# EAGLE design WBV2-final (EAGLE 9.6.2)
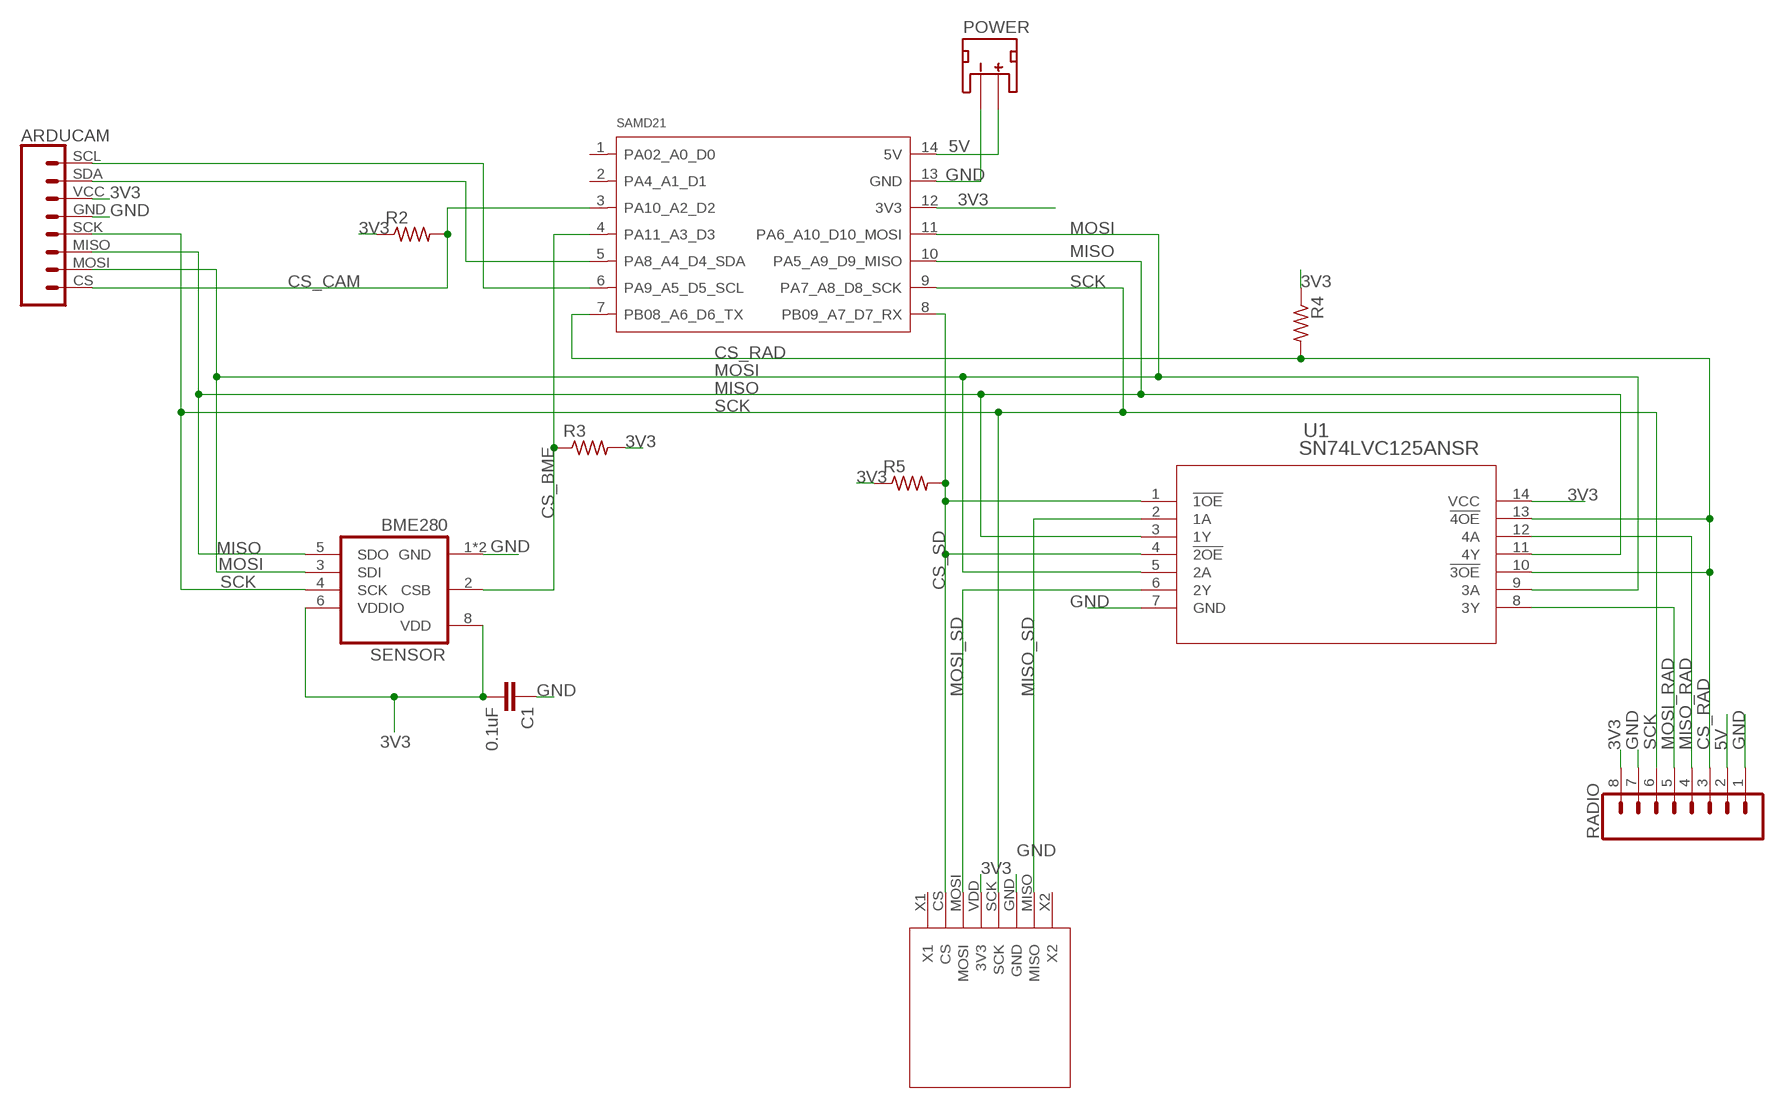
[diagram p0: schematic, sheet 1]

## Parts
C1  0.1uF  0.1UF-0402-16V-10%  [0402]
CAM  ARDUCAM_MINI  [ARDUCAM_MINI]
POWER  JST_2MM_MALE  [JST-2-SMD]
R2  R-US_R0402  [R0402]
R3  R-US_R0402  [R0402]
R4  R-US_R0402  [R0402]
R5  R-US_R0402  [R0402]
RADIO  CONN_08"  [1X08]
SAMD21  MOUDLE-SEEEDUINO-XIAO  [MOUDLE14P-2.54-21X17.8MM]
SD  SD_READER  [SDREAD]
SENSOR  BME280  [BME280]
U1  SN74LVC125ANSR  [NS14]

## Nets
3V3: C1.2 CAM.VCC R2.1 R3.2 R4.1 R5.1 RADIO.8 SAMD21.12(3V3) SD.VDD(3V3) SENSOR.6(VDDIO) SENSOR.8(VDD) U1.14(VCC)
5V: POWER.2(+) RADIO.2 SAMD21.14(5V)
CS_BME: R3.1 SAMD21.4(PA11_A3_D3) SENSOR.2(CSB)
CS_CAM: CAM.CS R2.2 SAMD21.3(PA10_A2_D2)
CS_RAD: R4.2 RADIO.3 SAMD21.7(PB08_A6_D6_TX) U1.10(!3OE) U1.13(!4OE)
CS_SD: R5.2 SAMD21.8(PB09_A7_D7_RX) SD.CS U1.1(!1OE) U1.4(!2OE)
GND: C1.1 CAM.GND POWER.1(-) RADIO.1 RADIO.7 SAMD21.13(GND) SD.GND SENSOR.1(GND) SENSOR.7(GND) U1.7(GND)
MISO: CAM.MISO SAMD21.10(PA5_A9_D9_MISO) SENSOR.5(SDO) U1.3(1Y) U1.11(4Y)
MISO_RAD: RADIO.4 U1.12(4A)
MISO_SD: SD.MISO U1.2(1A)
MOSI: CAM.MOSI SAMD21.11(PA6_A10_D10_MOSI) SENSOR.3(SDI) U1.5(2A) U1.9(3A)
MOSI_RAD: RADIO.5 U1.8(3Y)
MOSI_SD: SD.MOSI U1.6(2Y)
N$5: CAM.SDA SAMD21.5(PA8_A4_D4_SDA)
N$6: CAM.SCL SAMD21.6(PA9_A5_D5_SCL)
SCK: CAM.SCK RADIO.6 SAMD21.9(PA7_A8_D8_SCK) SD.SCK SENSOR.4(SCK)
Unconnected: POWER.NC1(PAD1) POWER.NC2(PAD2) SAMD21.1(PA02_A0_D0) SAMD21.2(PA4_A1_D1) SD.X1 SD.X2

## Library data of the parts
C1 = SparkFun-Capacitors:0.1UF: 0.1µF ceramic capacitors A capacitor is a passive two-terminal electrical component used to store electrical energy temporarily in an electric field.; PROD_ID: CAP-12416
CAM = project-library:ARDUCAM_MINI
POWER = SparkFun-Connectors:JST_2MM_MALE: JST 2MM MALE RA CONNECTOR Two pin, compact surface mount connector. Commonly used as a battery input connection point. We really like the solid locking feeling and high current rating on these small connectors. We use these all the time as battery connectors. Mates to single-cell LiPo batteries. Here is the connector we sell at SparkFun: JST Right Angle Connector - White <https://www.sparkfun.com/products/8612> (PRT-08612) Datasheet <http://www.sparkfun.com/datasheets/Prototyping/Connectors/JST-Horizontal.pdf> It was used on these SparkFun products: SparkFun MOSFET Power Controller <https://www.sparkfun.com/products/11214> (PRT-11214) SparkFun Battery Babysitter - LiPo Battery Manager <https://www.sparkfun.com/products/13777> (PRT-13777) And many, many others that required a lipo battery connection.; PROD_ID: CONN-11443; SF_ID: PRT-08612
R2-R5 = rcl:R-US_: RESISTOR, American symbol; SPICEPREFIX: R
RADIO = SparkFun-Connectors:CONN_08: Multi connection point. Often used as Generic Header-pin footprint for 0.1 inch spaced/style header connections On any of the 0.1 inch spaced packages, you can populate with these: Break Away Headers - Straight <https://www.sparkfun.com/products/116> (PRT-00116) Break Away Male Headers - Right Angle <https://www.sparkfun.com/products/553> (PRT-00553) Female Headers <https://www.sparkfun.com/products/115> (PRT-00115) Break Away Headers - Machine Pin <https://www.sparkfun.com/products/117> (PRT-00117) Break Away Female Headers - Swiss Machine Pin <https://www.sparkfun.com/products/743> (PRT-00743) Arduino Stackable Header - 8 Pin <https://www.sparkfun.com/products/9279> (PRT-09279) For SCREWTERMINALS and SPRING TERMINALS visit here: Screw Terimnals on SparkFun.com <https://www.sparkfun.com/search/results?term=Screw+Terminals> (5mm/3.5mm/2.54mm spacing) This device is also useful as a general connection point to wire up your design to another part of your project. Our various solder wires solder well into these plated through hole pads. Hook-Up Wire - Assortment (Stranded, 22 AWG) <https://www.sparkfun.com/products/11375> (PRT-11375) Hook-Up Wire - Assortment (Solid Core, 22 AWG) <https://www.sparkfun.com/products/11367> (PRT-11367) View the entire wire category on our website here <https://www.sparkfun.com/categories/141> Special notes: Molex polarized connector foot print use with SKU : PRT-08231 with associated crimp pins and housings. 1MM SMD Version SKU: PRT-10208 NOTES ON THE VARIANTS LOCK and LOCK_LONGPADS... This footprint was designed to help hold the alignment of a through-hole component (i.e. 6-pin header) while soldering it into place. You may notice that each hole has been shifted either up or down by 0.005 of an inch from it's more standard position (which is a perfectly straight line). This slight alteration caused the pins (the squares in the middle) to touch the edges of the holes. Because they are alternating, it causes a "brace" to hold the component in place. 0.005 has proven to be the perfect amount of "off-center" position when using our standard breakaway headers. Although looks a little odd when you look at the bare footprint, once you have a header in there, the alteration is very hard to notice. Also,if you push a header all the way into place, it is covered up entirely on the bottom side.; PROD_ID: CONN-08438
SAMD21 = Seeeduino-XIAO-footprint-eagle:MOUDLE-SEEEDUINO-XIAO
SD = project-library:SD_READER
SENSOR = bosch-bme280:BME280: DIGITAL HUMIDITY, PRESSURE AND TEMPERATURE SENSOR * Digital interface I²C (up to 3.4 MHz) and SPI (3 and 4 wire, up to 10 MHz)* Supply voltage VDD main supply voltage range: 1.71 V to 3.6 V*VDDIO interface voltage range: 1.2 V to 3.6 V Operating range -40…+85 °C, 0…100 % rel. humidity, 300…1100 hPa The library has been designed by Richard Magdycz <https://www.facebook.com/groups/eaglecadsoftUK>
U1 = SN74LVC125ANSR:SN74LVC125ANSR; COPYRIGHT: Copyright (C) 2024 Ultra Librarian. All rights reserved.; MANUFACTURER_PART_NUMBER: SN74LVC125ANSR; MFR_NAME: Texas Instruments

## Board
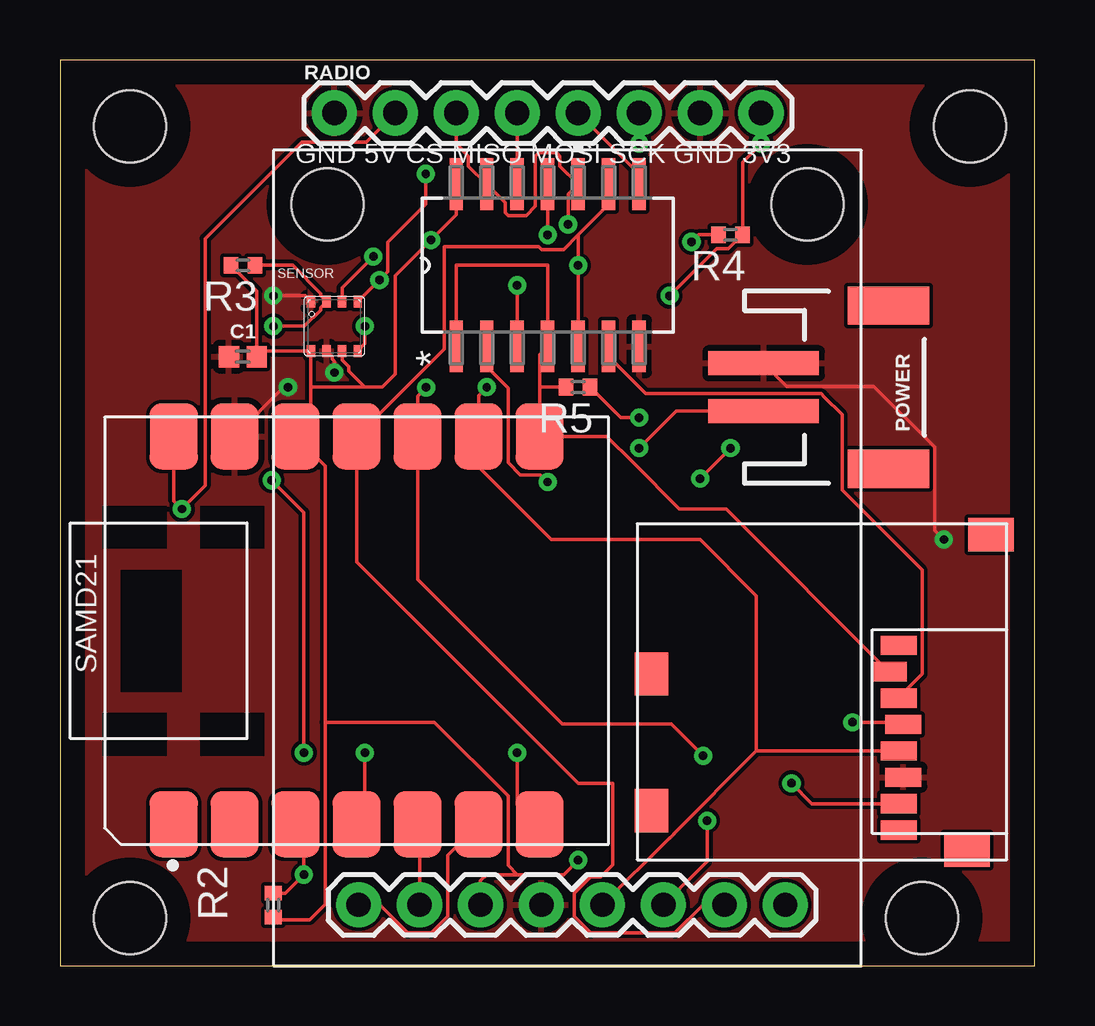
[diagram p1: board, top side]
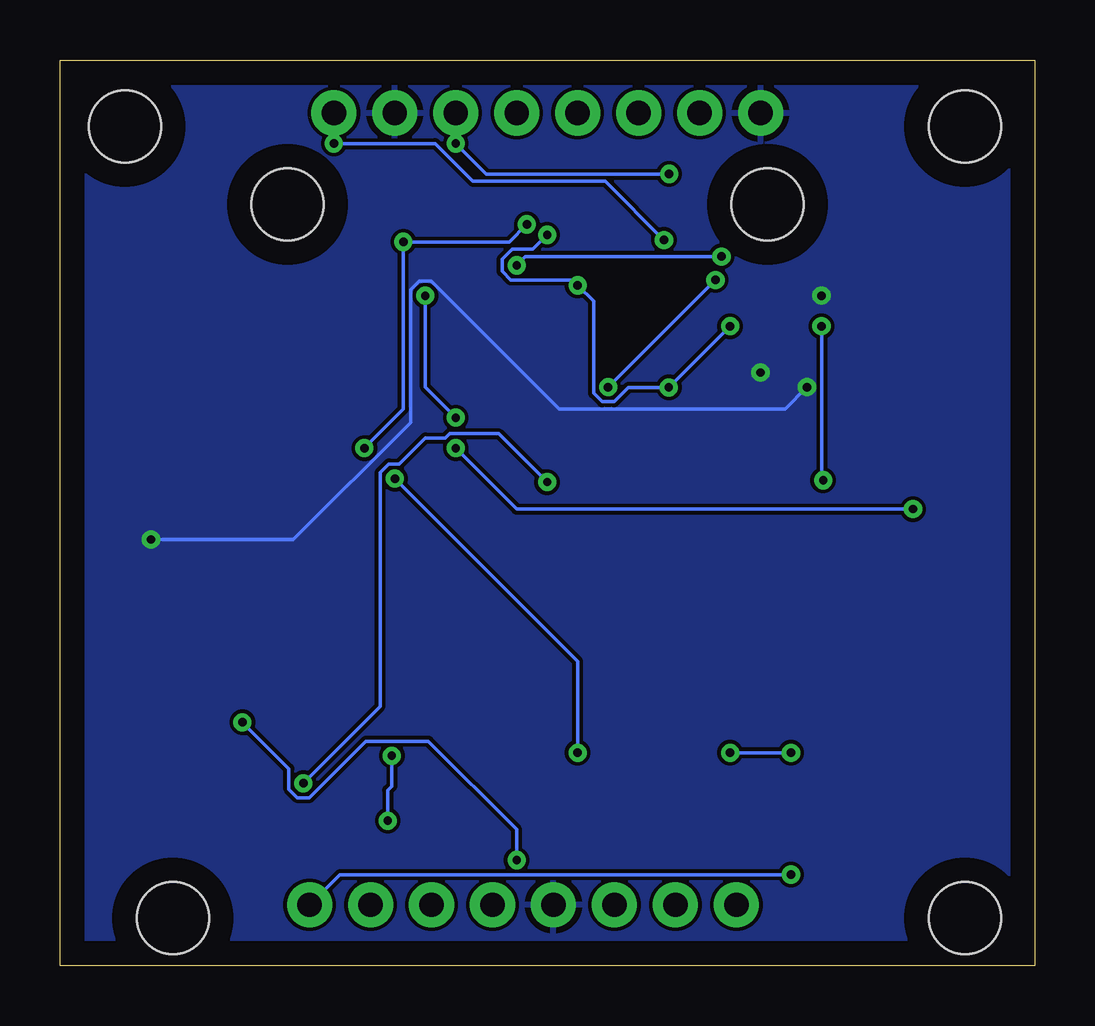
[diagram p2: board, bottom side, seen from below]

Size 40.62 x 37.77 mm. Coordinates in mm from the lower left corner, seen from the top.
Outline: 0,0 40.62,0 40.62,37.77 0,37.77 0,0
Copper layers (1*16): Top 0.035mm / dielectric 1.5mm / Bottom 0.035mm
Design rules "default": minimum track width 6mil, minimum drill 0.35mm, track to track 6mil, track to pad 6mil, pad to pad 6mil, via to via 6mil, smd to smd 6mil, copper to edge 40mil, drill to drill 6mil, minimum pad ring 10mil, minimum via ring 8mil, stop-mask expansion 4mil, vias tented up to drill 0mil, thermal gap 10mil
Holes 3 mm at 35.92,2 2.92,35 37.92,35 2.92,2

### Footprints (pad centres in the part's own frame; a part is rotated, then mirrored left to right if it is on the bottom)
0402 = smd 0.85 x 0.9: 1 -0.58,0; 2 0.58,0
ARDUCAM_MINI = drill 1.016 pad 1.88: CS 21.33,2.55; GND 11.17,2.55; MISO 16.25,2.55; MOSI 18.79,2.55; SCK 13.71,2.55; SCL 3.55,2.55; SDA 6.09,2.55; VCC 8.63,2.55 | hole 3: 22.25,31.75; 2.25,31.75
JST-2-SMD = smd 1 x 4.6: 1 -1,-3.7; 2 1,-3.7 | smd 1.6 x 3.4: NC1 -3.4,1.5; NC2 3.4,1.5
R0402 = smd 0.6 x 0.7: 1 -0.5,0; 2 0.5,0
1X08 = drill 1.016 pad 1.88: 1 0,0; 2 2.54,0; 3 5.08,0; 4 7.62,0; 5 10.16,0; 6 12.7,0; 7 15.24,0; 8 17.78,0
MOUDLE14P-2.54-21X17.8MM = smd 2.75 x 2: 1 0.835,18.12; 2 0.835,15.58; 3 0.835,13.04; 4 0.835,10.5; 5 0.835,7.96; 6 0.835,5.42; 7 0.835,2.88; 8 17,2.88; 9 17,5.42; 10 17,7.96; 11 17,10.5; 12 17,13.04; 13 17,15.58; 14 17,18.12
SDREAD = smd 0.8 x 1.5: CS 0.84,-2.79; GND -3.56,-3.39; MISO -4.66,-3.19; MOSI -0.26,-3.19; SCK -2.46,-3.19; VDD -1.36,-3.39; X1 1.94,-3.19; X2 -5.76,-3.19 | smd 1.4 x 1.9: P$1 6.55,-7.04; P$2 -6.6,-6.04 | smd 1.8 x 1.4: P$3 -4.95,7.11; P$4 0.75,7.11
BME280 = smd 0.35 x 0.5: 1 0.975,-1.025; 2 0.325,-1.025; 3 -0.325,-1.025; 4 -0.975,-1.025; 5 -0.975,1.025; 6 -0.325,1.025; 7 0.325,1.025; 8 0.975,1.025
NS14 = smd 2.159 x 0.559: 1 -3.378,3.81; 2 -3.378,2.54; 3 -3.378,1.27; 4 -3.378,0; 5 -3.378,-1.27; 6 -3.378,-2.54; 7 -3.378,-3.81; 8 3.378,-3.81; 9 3.378,-2.54; 10 3.378,-1.27; 11 3.378,0; 12 3.378,1.27; 13 3.378,2.54; 14 3.378,3.81

### Placement (x,y rotation side)
C1  7.62,25.4 0 top
CAM  8.89,0 0 top
POWER  33.02,24.13 270 top
R2  8.89,2.54 90 top
R3  7.62,29.21 180 top
R4  27.94,30.48 180 top
R5  21.59,24.13 180 top
RADIO  11.43,35.56 0 top
SAMD21  22.86,5.08 90 top
SD  31.75,11.43 90 top
SENSOR  11.43,26.67 180 top
U1  20.32,29.21 90 top

### Tracks (layer width: path | path; a pad name or v marks a point on that pad's centre or on a via)
3V3  (via drill 0.35)
  Top 0.152: 10.46,24.13 10.46,22.71 SAMD21.12 11.05,20.85 11.05,10.16 | 10.46,24.13 SENSOR.8 8.45,25.64 C1.2 8.2,28.13 R3.2 | U1.14 16.51,31.32 v15.46,30.26 13.97,28.78 13.97,24.68 13.42,24.13 12.7,24.13 | RADIO.8 v29.21,34.29 28.44,33.52 R4.1 28.41,30.48 27.84,29.9 27.36,29.9 v25.4,27.94 | v21.59,4.42 20.98,3.81 19.05,3.81 | 19.05,3.81 17.78,3.81 17.52,3.55 CAM.VCC | 19.05,3.81 18.67,4.19 18.67,7.09 15.6,10.16 11.05,10.16 | v24.13,22.86 23.36,22.86 R5.1 | 12.7,24.13 10.46,24.13 | R2.1 9,1.93 10.41,1.93 11.05,2.57 11.05,10.16 | SENSOR.6 11.76,25.27 12.04,24.99 12.04,24.79 12.7,24.13 | v33.02,10.16 35.05,10.16 SD.VDD
  Bottom 0.152: v15.46,30.26 17.91,32.72 23.41,32.72 24.99,34.29 v29.21,34.29 | v24.13,22.86 25.4,24.13 v25.4,27.94 | v21.59,4.42 21.59,5.69 25.27,9.37 27.87,9.37 30.23,7.01 30.73,7.01 31.09,7.37 31.09,8.23 v33.02,10.16
5V  (via drill 0.35)
  Top 0.152: POWER.2 25.67,23.13 v24.13,21.59 | SAMD21.14 4.74,19.39 v5.08,19.05 6.05,20.02 6.05,30.33 10.07,34.34 12.75,34.34 RADIO.2
  Bottom 0.152: v24.13,21.59 21.59,19.05 v5.08,19.05
CS_BME  (via drill 0.35)
  Top 0.152: v8.89,26.67 10.18,26.67 10.86,27.35 10.86,27.45 SENSOR.2 10.86,27.94 10.86,28.04 9.69,29.21 R3.1 | v8.82,20.25 10.16,18.91 v10.16,8.89 | v12.7,8.89 12.7,6.25 SAMD21.4
  Bottom 0.152: v8.89,26.67 8.89,20.32 v8.82,20.25 | v10.16,8.89 v12.7,8.89
CS_CAM  (via drill 0.35)
  Top 0.152: SAMD21.3 10.16,5.58 v10.16,3.81 9.39,3.04 R2.2
  Bottom 0.152: v10.16,3.81 28.96,3.81 CAM.CS
CS_RAD  (via drill 0.35)
  Top 0.152: RADIO.3 16.51,34.27 17.02,33.76 17.02,33.35 U1.13 18.54,31.83 18.54,31.41 18.68,31.28 19.42,31.28 19.81,31.67 19.81,33.76 19.95,33.9 20.69,33.9 20.83,33.76 20.83,33.35 U1.10 21.17,32.17 v21.17,30.92 | SAMD21.7 19.05,6.84 v19.05,8.89 | v26.67,20.32 v27.94,21.59 | R4.2 26.61,30.48 v26.31,30.18
  Bottom 0.152: v19.05,8.89 19.05,12.7 v26.67,20.32 | v21.17,30.92 21.9,30.18 v26.31,30.18 26.31,23.22 v27.94,21.59
CS_SD
  Top 0.152: 19.98,24.13 SAMD21.8 22.78,22.08 23.88,20.98 25.81,19.05 27.76,19.05 SD.CS | 19.98,24.13 19.98,25.49 U1.4 20.32,29.21 16.51,29.21 U1.1 | R5.2 19.98,24.13
GND  (via drill 0.35)
  Top 0.152: SENSOR.1 10.21,27.94 v8.89,27.94 | SENSOR.7 11.35,25.4 11.35,25.3 11.43,25.22 v11.43,24.74 | POWER.1 30.29,24.16 33.91,24.16 36.45,21.62 36.45,18.16 v36.83,17.78 | v9.5,24.13 9.33,24.13 SAMD21.13
  Bottom 0.152: v9.5,24.13 10.41,23.22 19.82,23.22 25.15,28.55 25.65,28.55 26.01,28.19 26.01,22.66 30.89,17.78 v36.83,17.78
  pour Top: -4.17,42.49 40.64,42.49 40.64,0 -4.17,0
  pour Bottom: -4.22,39.9 40.64,39.9 40.64,0 -4.22,0
MISO  (via drill 0.35)
  Top 0.152: v15.25,24.12 14.9,23.76 SAMD21.10 14.9,16.11 20.92,10.08 25.48,10.08 v26.8,8.76 | v12.7,26.67 12.7,25.94 SENSOR.5 | v20.32,30.48 U1.11 | v26.96,6.06 26.96,4.37 CAM.MISO | v19.05,28.37 U1.3
  Bottom 0.152: v12.7,26.67 v15.25,24.12 16.94,24.12 17.53,23.52 18.03,23.52 18.39,23.88 18.39,27.71 v19.05,28.37 19.28,28.6 21.84,28.6 22.2,28.96 22.2,29.46 21.78,29.88 20.92,29.88 v20.32,30.48 | v26.96,6.06 26.96,7.33 26.8,7.49 v26.8,8.76
MISO_RAD
  Top 0.152: RADIO.4 U1.12
MISO_SD  (via drill 0.35)
  Top 0.152: v20.32,20.17 20.02,20.48 19.18,20.48 18.67,20.99 18.67,24.1 17.78,24.99 U1.2 | SD.MISO 31.33,6.77 v30.48,7.62
  Bottom 0.152: v20.32,20.17 22.34,22.2 24.38,22.2 24.56,22.02 25.4,22.02 26.49,20.93 26.92,20.93 27.28,20.57 27.28,10.82 v30.48,7.62
MOSI  (via drill 0.35)
  Top 0.152: U1.5 v21.59,29.21 21.59,30.48 | 21.59,30.48 22.86,31.75 U1.9 | SENSOR.3 11.76,28.27 v13.06,29.57 | CAM.MOSI 26.79,2.55 25.62,1.38 22.12,1.38 21.43,2.07 21.43,3.03 22.12,3.72 22.53,3.72 23.03,4.21 23.03,7.62 21.59,7.62 12.36,16.85 SAMD21.11 16,25.72 16,29.98 19.96,29.98 20.07,29.87 20.98,29.87 21.59,30.48
  Bottom 0.152: v13.06,29.57 21.23,29.57 v21.59,29.21
MOSI_RAD
  Top 0.152: RADIO.5 24.13,33.02 U1.8
MOSI_SD
  Top 0.152: U1.6 22.86,25.4 24.4,23.86 31.72,23.86 31.85,23.73 32.59,22.98 32.59,19.84 35.92,16.51 35.92,12.18 34.94,11.2 SD.MOSI
N$5
  Top 0.152: SAMD21.5 14.98,5.83 CAM.SDA
N$6
  Top 0.152: CAM.SCL 13.33,2.55 14.5,1.38 15.46,1.38 16.15,2.07 16.15,4.62 SAMD21.6
SCK  (via drill 0.35)
  Top 0.152: RADIO.6 v24.13,34.29 | v15.24,33.02 15.24,31.75 13.67,30.17 13.67,28.95 v13.31,28.6 SENSOR.4 | v17.78,24.13 17.44,23.79 SAMD21.9 17.44,20.81 20.47,17.78 26.67,17.78 29.02,15.43 29.02,8.97 | SD.SCK 29.02,8.97 | 29.02,8.97 25.57,5.52 25.57,5.49 25.44,5.35 25.4,5.35 CAM.SCK
  Bottom 0.152: v24.13,34.29 22.86,33.02 v15.24,33.02 | v17.78,24.13 v13.31,28.6

### Text on the board
tNames: GND 5V CS MISO MOSI SCK GND 3V3